# EAGLE design Graphic LCD Backpack (EAGLE 6.4)
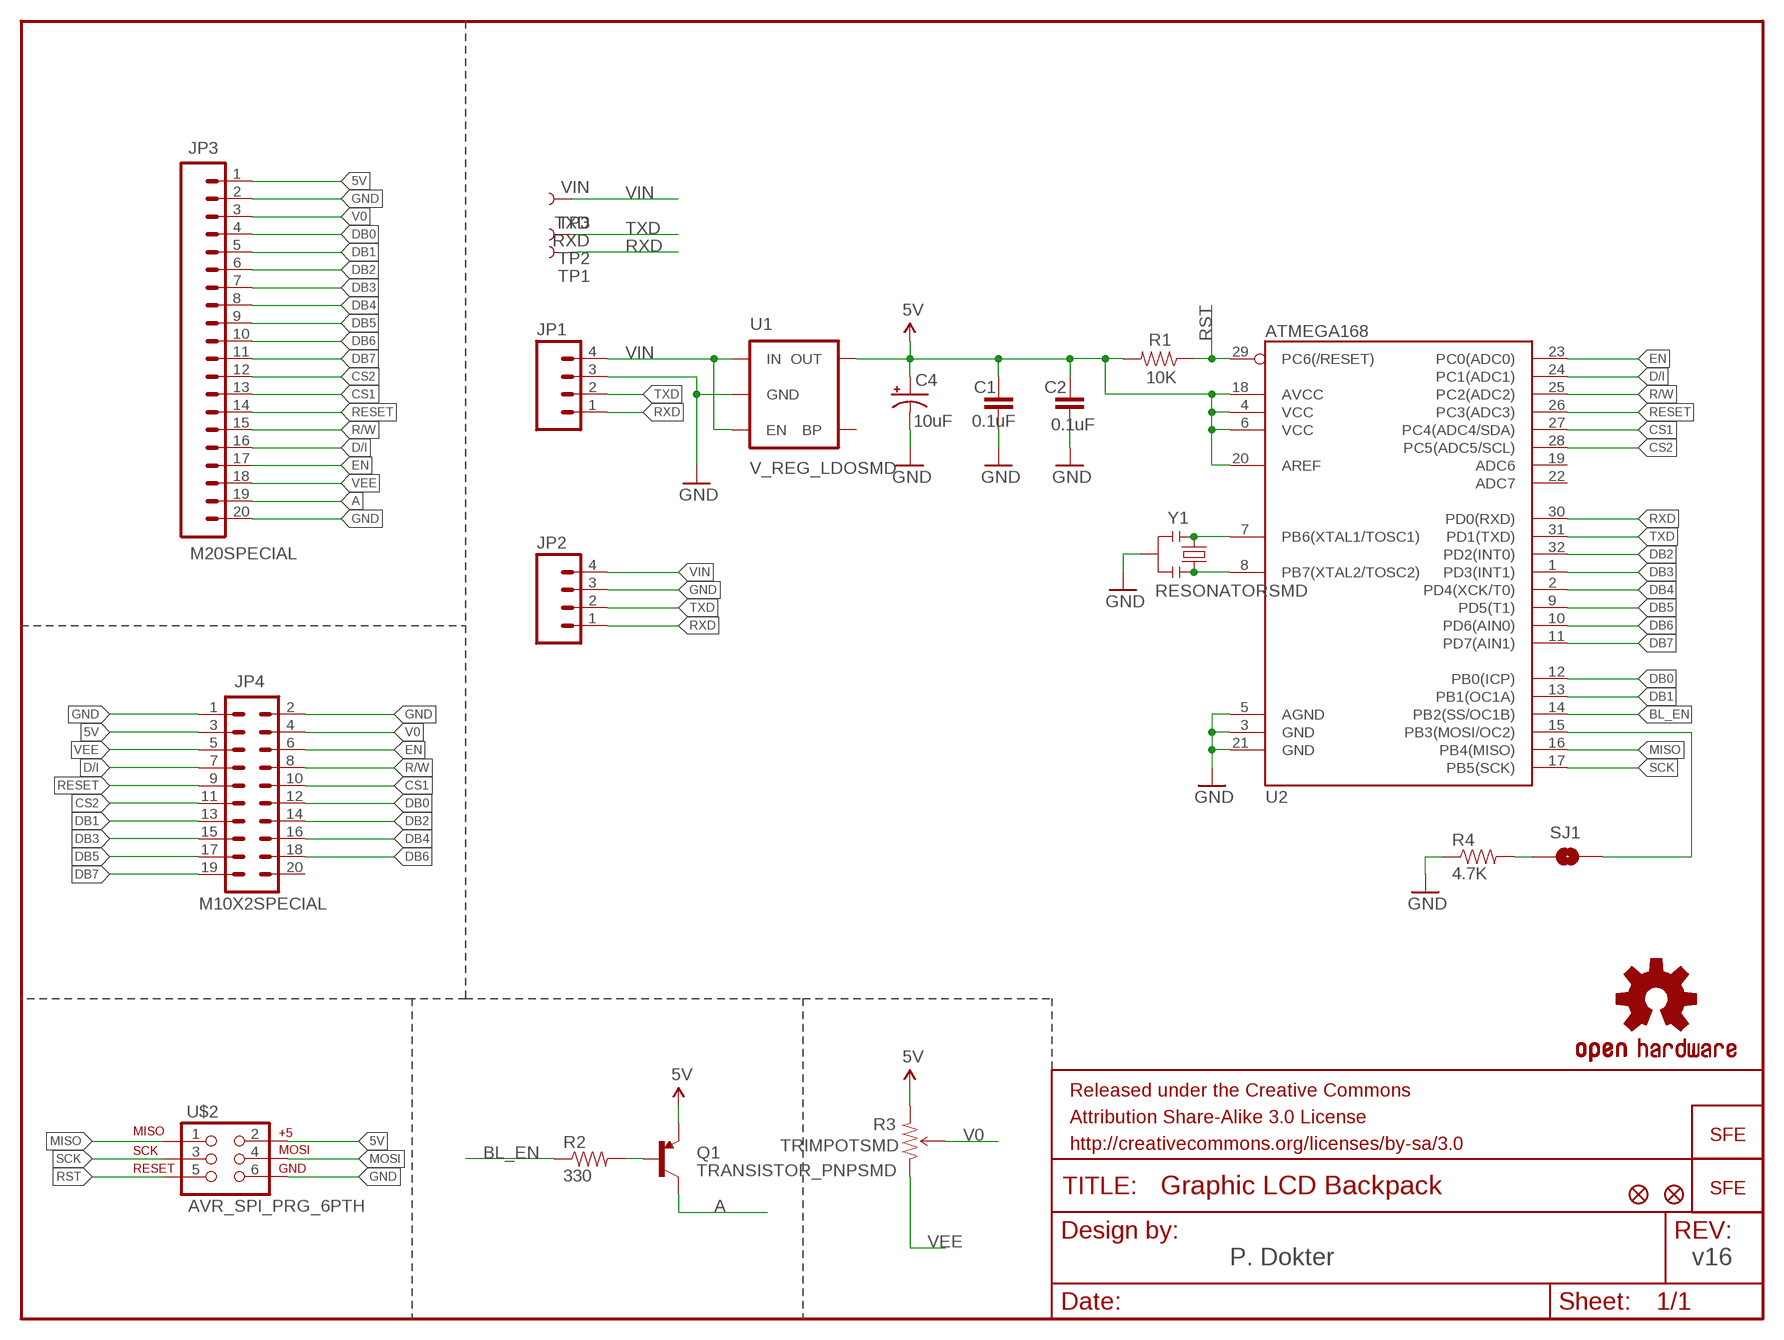
[diagram p0: schematic, sheet 1]

## Parts
C1  0.1uF  CAP0603-CAP  [0603-CAP]
C2  0.1uF  CAP0603-CAP  [0603-CAP]
C4  10uF  CAP_POL1206  [EIA3216]
FRAME1  FRAME-LETTER  [CREATIVE_COMMONS]
JP1  M04SMD  [1X04-SMD]
JP2  M04PTH  [1X04]
JP3  M20SPECIAL  [1X20_LOCK_SPECIAL]
JP4  M10X2SPECIAL  [2X10_LOCK_SPECIAL]
LOGO1  OSHW-LOGOL  [OSHW-LOGO-L]
LOGO2  LOGO-SFENEW  [SFE-NEW-WEBLOGO]
LOGO3  OSHW-LOGOS  [OSHW-LOGO-S]
Q1  TRANSISTOR_PNPSMD  [SOT23-3]
R1  10K  RESISTOR0603-RES  [0603-RES]
R2  330  RESISTOR0603-RES  [0603-RES]
R3  TRIMPOTSMD  [TRIMPOT-3MM]
R4  4.7K  RESISTOR0603-RES  [0603-RES]
SJ1  SOLDERJUMPERNC2  [SJ_2S-NOTRACE]
TP1  RXD  TEST-POINT3X5  [PAD.03X.05]
TP2  TXD  TEST-POINT3X5  [PAD.03X.05]
TP3  VIN  TEST-POINT3X5  [PAD.03X.05]
U1  V_REG_LDOSMD  [SOT23-5]
U2  ATMEGA168  [TQFP32-08]
U$2  AVR_SPI_PRG_6PTH  [2X3]
U$8  LOGO-SFENEW  [SFE-NEW-WEBLOGO]
U$9  FIDUCIAL1X2  [FIDUCIAL-1X2]
U$10  FIDUCIAL1X2  [FIDUCIAL-1X2]
Y1  RESONATORSMD  [RESONATOR-SMD]

## Nets
5V: C1.1 C2.2 C4.A(+) JP3.1 JP4.3 Q1.2(E) R1.2 R3.3(CW) U1.5(OUT) U2.4(VCC) U2.6(VCC) U2.18(AVCC) U2.20(AREF) U$2.2
A: JP3.19 Q1.3(C)
BL_EN: R2.1 U2.14(PB2(SS/OC1B))
CS1: JP3.13 JP4.10 U2.27(PC4(ADC4/SDA))
CS2: JP3.12 JP4.11 U2.28(PC5(ADC5/SCL))
D/I: JP3.16 JP4.7 U2.24(PC1(ADC1))
DB0: JP3.4 JP4.12 U2.12(PB0(ICP))
DB1: JP3.5 JP4.13 U2.13(PB1(OC1A))
DB2: JP3.6 JP4.14 U2.32(PD2(INT0))
DB3: JP3.7 JP4.15 U2.1(PD3(INT1))
DB4: JP3.8 JP4.16 U2.2(PD4(XCK/T0))
DB5: JP3.9 JP4.17 U2.9(PD5(T1))
DB6: JP3.10 JP4.18 U2.10(PD6(AIN0))
DB7: JP3.11 JP4.19 U2.11(PD7(AIN1))
EN: JP3.17 JP4.6 U2.23(PC0(ADC0))
GND: C1.2 C2.1 C4.C(-) JP1.3 JP2.3 JP3.2 JP3.20 JP4.1 JP4.2 R4.1 U1.2(GND) U2.3(GND) U2.5(AGND) U2.21(GND) U$2.6 Y1.2
MISO: U2.16(PB4(MISO)) U$2.1
MOSI: SJ1.2 U2.15(PB3(MOSI/OC2)) U$2.4
N$1: Q1.1(B) R2.2
N$2: U2.7(PB6(XTAL1/TOSC1)) Y1.1
N$3: U2.8(PB7(XTAL2/TOSC2)) Y1.3
N$4: R4.2 SJ1.1
R/W: JP3.15 JP4.8 U2.25(PC2(ADC2))
RESET: JP3.14 JP4.9 U2.26(PC3(ADC3))
RST: R1.1 U2.29(PC6(/RESET)) U$2.5
RXD: JP1.1 JP2.1 TP1.P$1 U2.30(PD0(RXD))
SCK: U2.17(PB5(SCK)) U$2.3
TXD: JP1.2 JP2.2 TP2.P$1 U2.31(PD1(TXD))
V0: JP3.3 JP4.4 R3.2(WIPER)
VEE: JP3.18 JP4.5 R3.1(CCW)
VIN: JP1.4 JP2.4 TP3.P$1 U1.1(IN) U1.3(EN)
Unconnected: JP4.20 U1.4(BP) U2.19(ADC6) U2.22(ADC7)

## Notes on the sheet
- P. Dokter | v16

## Library data of the parts
C1 C2 = SparkFun:CAP: Capacitor Standard 0603 ceramic capacitor, and 0.1" leaded capacitor.
C4 = SparkFun:CAP_POL: Capacitor Polarized These are standard SMD and PTH capacitors. Normally 10uF, 47uF, and 100uF in electrolytic and tantalum varieties. Always verify the external diameter of the through hole cap, it varies with capacity, voltage, and manufacturer. The EIA devices should be standard.
FRAME1 = SparkFun-Aesthetics:FRAME-LETTER: Schematic Frame Standard 8.5x11 US Letter frame
JP1 JP2 = SparkFun:M04: Header 4 Standard 4-pin 0.1" header. Use with straight break away headers (SKU : PRT-00116), right angle break away headers (PRT-00553), swiss pins (PRT-00743), machine pins (PRT-00117), and female headers (PRT-00115). Molex polarized connector foot print use with SKU : PRT-08231 with associated crimp pins and housings.
JP3 = SparkFun:M20: This is just like the LOCK variant in that the holes are staggared by 5 mil, but except for the last two holes. They are not altered from the "standard" footprint layout. This is used for a special purpose on the layout of our Graphic LCD Backpack. Make sure you want to use this device before selecting it for you project!
JP4 = SparkFun:M10X2: This was SPECIALLY designed to be used with our Graphic LCD Backpack. Be sure you want to use this! It is not only staggered on each line of header holes, but IT IS ALSO offset of the center point of the top and bottom lines by 5 mil. This causes the headers to lock into place on the "standard" footprint on the LCD screen. The extra squares on the tdocu layer are there simply to reference other pins (if you were to actually populate a longer header than ten long - this is what we do with the backpacks).
LOGO1 LOGO3 = SparkFun-Aesthetics:OSHW-LOGO: Open Source Hardware Logo This logo indicates the piece of hardware it is found on incorporates a OSHW license and/or adheres to the definition of open source hardware found here: http://freedomdefined.org/OSHW
LOGO2 = SparkFun-Aesthetics:LOGO-SFE: Spark Fun Electronics PCB Logo This is the standard Spark Fun Electronics PCB logo.
Q1 = SparkFun:TRANSISTOR_PNP
R1 R2 R4 = SparkFun:RESISTOR: Resistor Basic schematic elements and footprints for 0603, 1206, and PTH 1/10th watt (small) resistors.
R3 = SparkFun:TRIMPOT
SJ1 = SparkFun:SOLDERJUMPER: Solder Jumper Standard SMD solder jumper. Used to automate production. Two varients : Normally Open and Normally Closed are the same, but have different paste layers. NC will have a large amount of paste and should jumper during reflow.
TP1-TP3 = SparkFun:TEST-POINT
U1 = SparkFun:V_REG_LDO: Voltage Regulator LDO Standard 150mA LDO voltage regulator in SOT-23 layout. Micrel part MIC5205. BP (by-pass) pin is used to lower output noise with 470pF cap.
U2 = SparkFun:ATMEGA168
U$2 = SparkFun:AVR_SPI_PRG_6: AVR ISP 6 Pin This is the reduced ISP connector for AVR programming. Common on Arduino. This footprint will take up less PCB space and can be used with a 10-pin to 6-pin adapter such as SKU: BOB-08508
U$8 = SparkFun:LOGO-SFE: Spark Fun Electronics PCB Logo This is the standard Spark Fun Electronics PCB logo.
U$9 U$10 = SparkFun:FIDUCIAL: Fiducial Alignment Points Various fiducial points for machine vision alignment.
Y1 = SparkFun:RESONATOR: Resonator Small SMD resonator. This is the itty bitty 10/20MHz resonators with built in caps. CSTCE10M0G55 and CSTCE20M0V53. Footprint has been reviewed closely but hasn't been tested yet.

## Board
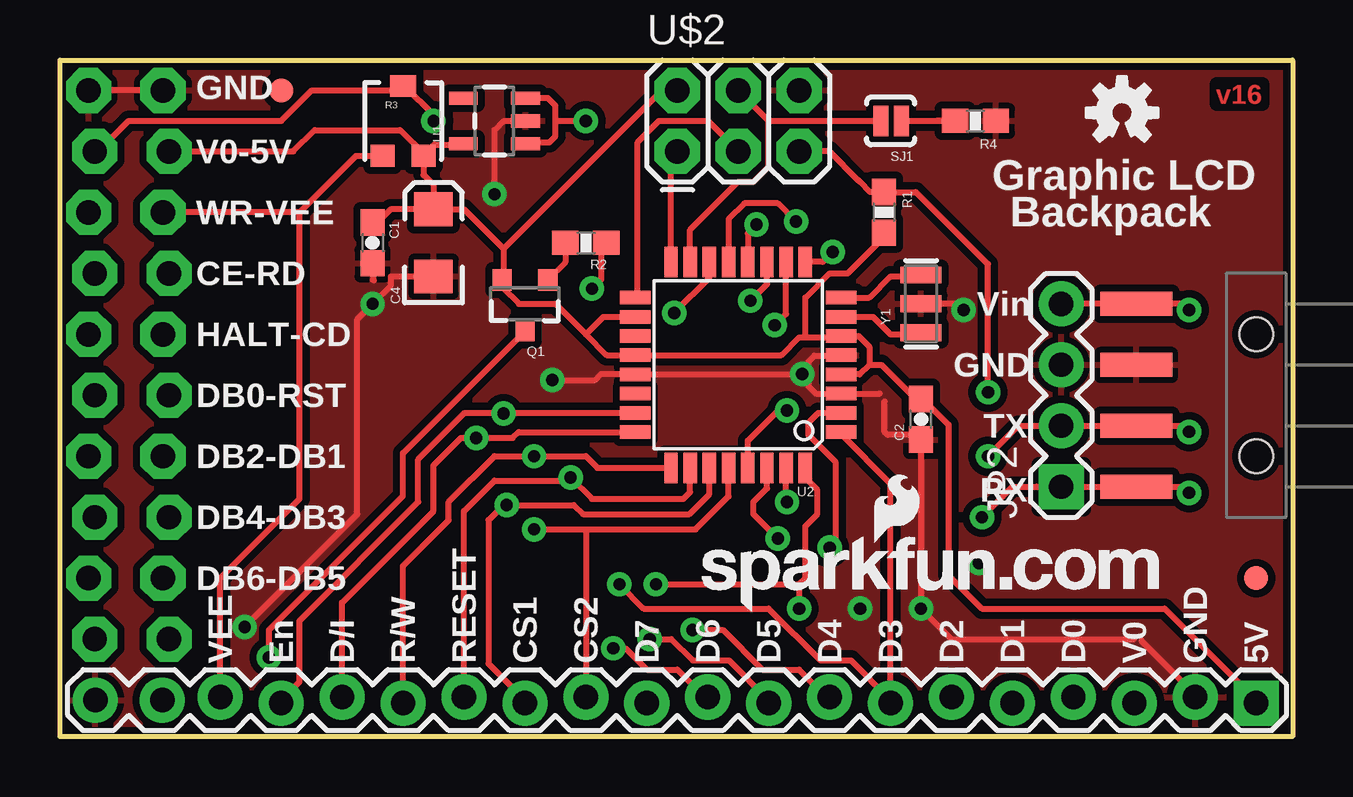
[diagram p1: board, top side]
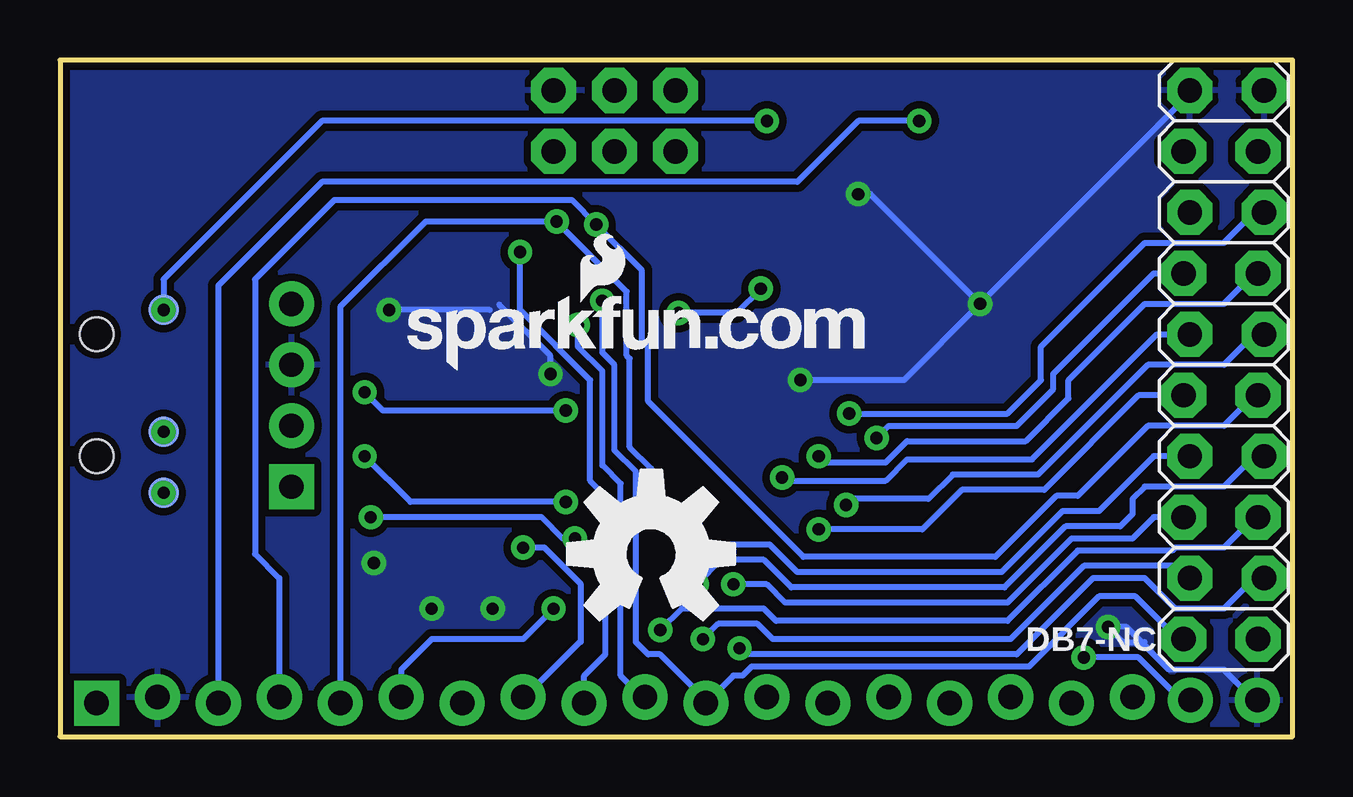
[diagram p2: board, bottom side, seen from below]

Size 51.38 x 28.19 mm. Coordinates in mm from the lower left corner, seen from the top.
Outline: 0,0 0,28.19 51.38,28.19 51.38,0 0,0
Copper layers (1*16): Top 0.035mm / dielectric 1.5mm / Bottom 0.035mm
Design rules "SparkFun *": minimum track width 8mil, minimum drill 20mil, track to track 8mil, track to pad 8mil, pad to pad 8mil, via to via 8mil, smd to smd 6mil, copper to edge 8mil, drill to drill 8mil, minimum pad ring 12mil, minimum via ring 10mil, stop-mask expansion 4mil, vias tented up to drill 25mil, thermal gap 10mil

### Footprints (pad centres in the part's own frame; a part is rotated, then mirrored left to right if it is on the bottom)
0603-CAP = smd 1.1 x 1: 1 -0.85,0; 2 0.85,0
EIA3216 = smd 1.4 x 1.6: A 1.4,0; C -1.4,0
1X04-SMD = smd 1 x 3: 1 -3.81,5; 2 -1.27,5; 3 1.27,5; 4 3.81,5 | hole 1.4: -2.54,0; 2.54,0
1X04 = drill 1.016 pad 1.88 square: 1 0,0 | drill 1.016 pad 1.88: 2 2.54,0; 3 5.08,0; 4 7.62,0
1X20_LOCK_SPECIAL = drill 1.016 pad 1.88 square: 1 0,0.127 | drill 1.016 pad 1.88: 2 2.54,-0.127; 3 5.08,0.127; 4 7.62,-0.127; 5 10.16,0.127; 6 12.7,-0.127; 7 15.24,0.127; 8 17.78,-0.127; 9 20.32,0.127; 10 22.86,-0.127; 11 25.4,0.127; 12 27.94,-0.127; 13 30.48,0.127; 14 33.02,-0.127; 15 35.56,0.127; 16 38.1,-0.127; 17 40.64,0.127; 18 43.18,-0.127; 19 45.593,0; 20 48.387,0
2X10_LOCK_SPECIAL = drill 1.016 pad 1.88 octagon: 1 -11.43,-1.422; 2 -11.43,1.676; 3 -8.89,-1.676; 4 -8.89,1.422; 5 -6.35,-1.422; 6 -6.35,1.676; 7 -3.81,-1.676; 8 -3.81,1.422; 9 -1.27,-1.422; 10 -1.27,1.676; 11 1.27,-1.676; 12 1.27,1.422; 13 3.81,-1.422; 14 3.81,1.676; 15 6.35,-1.676; 16 6.35,1.422; 17 8.89,-1.422; 18 8.89,1.676; 19 11.43,-1.676; 20 11.43,1.422
SOT23-3 = smd 0.8 x 0.9: 1 -0.95,-1; 2 0.95,-1; 3 0,1.1
0603-RES = smd 1.1 x 1: 1 -0.85,0; 2 0.85,0
TRIMPOT-3MM = smd 1 x 0.9: 1 -0.85,-1.45; 3 0.85,-1.45 | smd 1.1 x 0.9: 2 0,1.45
SJ_2S-NOTRACE = smd 0.635 x 1.27: 1 -0.45,0; 2 0.4,0
PAD.03X.05 = smd 1.27 x 1.27: P$1 0,0
SOT23-5 = smd 0.55 x 1.2: 1 -0.95,-1.3; 2 0,-1.3; 3 0.95,-1.3; 4 0.95,1.3; 5 -0.95,1.3
TQFP32-08 = smd 1.27 x 0.559: 1 -4.293,2.8; 2 -4.293,2; 3 -4.293,1.2; 4 -4.293,0.4; 5 -4.293,-0.4; 6 -4.293,-1.2; 7 -4.293,-2; 8 -4.293,-2.8; 17 4.293,-2.8; 18 4.293,-2; 19 4.293,-1.2; 20 4.293,-0.4; 21 4.293,0.4; 22 4.293,1.2; 23 4.293,2; 24 4.293,2.8 | smd 0.559 x 1.27: 9 -2.8,-4.293; 10 -2,-4.293; 11 -1.2,-4.293; 12 -0.4,-4.293; 13 0.4,-4.293; 14 1.2,-4.293; 15 2,-4.293; 16 2.8,-4.293; 25 2.8,4.293; 26 2,4.293; 27 1.2,4.293; 28 0.4,4.293; 29 -0.4,4.293; 30 -1.2,4.293; 31 -2,4.293; 32 -2.8,4.293
2X3 = drill 1.016 pad 1.88 octagon: 1 0,0; 2 0,2.54; 3 2.54,0; 4 2.54,2.54; 5 5.08,0; 6 5.08,2.54
FIDUCIAL-1X2 = smd 1 x 1: 1 0,0
RESONATOR-SMD = smd 0.7 x 1.7: 1 -1.2,0; 2 0,0; 3 1.2,0

### Placement (x,y rotation side)
C1  13.03,20.57 270 top
C2  35.89,13.22 90 top
C4  15.57,20.57 90 top
FRAME1  -0.28,-6.35 0 top  (outside the outline)
JP1  49.86,14.22 90 top
JP2  41.73,10.41 90 top
JP3  49.86,1.52 180 top
JP4  2.87,15.49 270 bottom
LOGO1  26.75,7.62 0 bottom
LOGO2  36.91,15.24 0 bottom
LOGO3  44.27,26 0 top
Q1  19.38,18.03 180 top
R1  34.35,21.84 270 top
R2  21.92,20.57 180 top
R3  14.3,25.65 0 top
R4  38.16,25.65 180 top
SJ1  34.62,25.65 180 top
TP1  47.07,10.16 0 bottom
TP2  47.07,12.7 0 bottom
TP3  47.07,17.78 0 bottom
U1  18.11,25.65 90 top
U2  28.27,15.49 180 top
U$2  25.73,24.38 0 top
U$8  26.75,5.21 0 top
U$9  9.22,26.92 0 top
U$10  49.86,6.6 0 top
Y1  35.89,18.03 90 top

### Tracks (layer width: path | path; a pad name or v marks a point on that pad's centre or on a via)
5V
  Top 0.254: 16.81,24.67 U1.5 | 21.92,16.76 20.65,18.03 19.13,18.03 18.43,18.73 Q1.2 18.48,19.03 18.49,19.05 18.49,20.32 | 16.81,24.67 17.12,24.67 | 33.73,15.49 33.73,16.26 33.29,16.69 U2.6 32.56,16.66 32.59,16.64 31.06,16.64 | 33.73,15.49 34.24,15.49 35.66,14.07 C2.2 36,14.07 36.08,14 36.08,13.96 37.03,13 37.03,6.73 38.43,5.33 46.05,5.33 49.86,1.52 JP3.1 | U2.18 22.65,17.49 21.92,16.76 | 21.92,16.76 22.79,15.89 U2.20 30.07,15.89 30.81,16.64 31.06,16.64 | U$2.2 25.1,26.92 18.49,20.32 | 31.06,16.64 31.06,18.29 32.08,19.3 32.84,19.3 34.35,20.81 R1.2 | U2.4 33.33,15.09 33.73,15.49 | 16.81,24.67 15.6,24.67 15.19,24.26 | JP4.3 9.73,24.38 10.62,25.27 14.17,25.27 15.19,24.26 | 15.19,24.26 15.15,24.22 R3.3 15.15,23.41 15.57,22.99 C4.A | C4.A 13.78,21.97 13.23,21.42 C1.1 | C4.A 16.84,21.97 18.49,20.32
A  (via drill 0.51)
  Top 0.254: Q1.3 19.38,16.89 14.3,11.81 14.3,10.03 8.71,4.45 v8.71,3.3
  Bottom 0.254: v8.71,3.3 6.43,3.3 4.65,1.52 JP3.19
BL_EN  (via drill 0.51)
  Top 0.254: R2.1 22.56,20.57 22.56,19.05 v22.17,18.67 | U2.14 27.07,19.12 v25.6,17.65
  Bottom 0.254: v25.6,17.65 23.19,17.65 v22.17,18.67
CS1  (via drill 0.51)
  Top 0.254: U2.27 27.07,10.1 26.24,9.27 21.79,9.27 21.41,9.65 v18.62,9.65 18.49,9.65 17.86,9.02 17.86,3.05 19.38,1.52 JP3.13
  Bottom 0.254: v18.62,9.65 18.36,9.91 15.19,9.91 14.17,10.92 10.62,10.92 6.05,15.49 2.87,15.49 1.6,16.76 JP4.10
CS2  (via drill 0.51)
  Top 0.254: v19.76,8.64 21.92,8.64 | 21.92,8.64 26.49,8.64 27.87,10.01 U2.28 | 21.92,8.64 JP3.12
  Bottom 0.254: JP4.11 6.43,14.22 10.36,10.29 13.79,10.29 15.44,8.64 v19.76,8.64
D/I  (via drill 0.51)
  Top 0.254: JP3.16 11.76,5.59 15.57,9.4 15.57,11.3 16.71,12.45 v17.35,12.45 18.87,12.45 19.13,12.7 19.13,12.69 U2.24
  Bottom 0.254: JP4.7 5.79,19.3 9.98,15.11 9.98,14.48 11.51,12.95 16.84,12.95 v17.35,12.45
DB0  (via drill 0.51)
  Top 0.254: U2.12 28.67,20.97 v29.03,21.34
  Bottom 0.254: JP3.4 42.24,6.6 43.26,7.62 43.26,19.05 39.95,22.35 30.05,22.35 v29.03,21.34 27.13,19.43 27.13,16.51 26.87,16.26 26.87,13.97 20.4,7.49 12.4,7.49 9.86,10.03 8.97,10.03 6.05,12.95 2.87,12.95 1.6,14.22 JP4.12
DB1  (via drill 0.51)
  Top 0.254: U2.13 27.87,21.57 28.52,22.23 29.92,22.23 v30.68,21.46
  Bottom 0.254: JP3.5 39.7,17.91 36.14,21.46 v30.68,21.46 27.76,18.54 27.76,15.88 27.64,15.75 27.64,12.06 26.75,11.18 26.75,9.91 24.84,8 21.79,8 20.65,6.86 12.14,6.86 9.6,9.4 8.08,9.4 5.79,11.68 JP4.13
DB2  (via drill 0.51)
  Top 0.254: 30.81,6.35 v30.81,5.33 | v24.84,6.35 30.81,6.35 | U2.32 31.07,10.79 31.57,10.29 31.57,9.27 31.06,8.76 31.06,6.6 30.81,6.35
  Bottom 0.254: JP3.6 37.16,2.79 35.89,4.06 32.08,4.06 v30.81,5.33 | v24.84,6.35 23.83,7.37 22.05,7.37 20.9,6.22 12.01,6.22 9.47,8.76 7.19,8.76 6.68,9.27 6.68,9.91 6.17,10.41 2.87,10.41 1.6,11.68 JP4.14
DB3  (via drill 0.51)
  Top 0.254: v23.32,6.35 24.33,5.33 29.54,5.33 31.7,3.17 32.97,3.17 34.62,1.52 JP3.7 34.62,10.54 32.56,12.6 U2.1
  Bottom 0.254: v23.32,6.35 21.92,6.35 21.16,5.59 11.89,5.59 9.22,8.26 6.68,8.26 5.79,9.14 JP4.15
DB4  (via drill 0.51)
  Top 0.254: v32.08,7.87 32.33,8.13 32.33,11.43 31.19,12.57 31.19,13.08 31.6,13.49 U2.2 | v26.37,4.45 27.64,4.45 29.29,2.79 30.81,2.79 31.95,1.65 JP3.8
  Bottom 0.254: v32.08,7.87 31.19,7.87 29.67,6.35 29.67,4 | 29.67,3.94 29.67,4 | v26.37,4.45 25.48,5.33 22.05,5.33 21.54,4.83 11.89,4.83 8.97,7.75 5.03,7.75 4.9,7.87 2.87,7.87 1.6,9.14 JP4.16 | JP3.8 32.02,1.65 29.67,4
DB5  (via drill 0.51)
  Top 0.254: U2.9 31.8,19.79 v32.21,20.19 | v24.59,4.06 25.48,4.06 26.37,3.17 27.89,3.17 29.54,1.52 JP3.9
  Bottom 0.254: v24.59,4.06 23.95,4.7 22.3,4.7 21.67,4.06 11.76,4.06 8.71,7.11 4.65,7.11 4.65,6.96 JP4.17 | JP3.9 29.54,2.54 28.65,3.43 28.65,10.03 29.29,10.67 29.29,14.86 32.21,17.78 v32.21,20.19
DB6  (via drill 0.51)
  Top 0.254: v23.06,3.68 23.57,3.68 24.46,2.79 25.73,2.79 26.87,1.65 JP3.10 | U2.10 30.27,17.62 v29.79,17.14
  Bottom 0.254: v23.06,3.68 22.81,3.43 11.51,3.43 8.33,6.6 6.17,6.6 4.9,5.33 2.87,5.33 1.6,6.6 JP4.18 | v29.79,17.14 29.79,16.26 28.78,15.24 28.78,11.3 28.02,10.54 28.02,2.54 27.13,1.65 JP3.10
DB7  (via drill 0.51)
  Top 0.254: U2.11 29.47,18.85 v28.78,18.16
  Bottom 0.254: JP4.19 4.78,4.06 6.55,5.84 8.08,5.84 11,2.92 22.56,2.92 22.94,2.54 23.32,2.54 JP3.11 24.46,1.52 26.37,3.43 26.87,3.43 27.38,3.94 27.38,11.05 28.27,11.94 28.27,15.49 28.78,16 v28.78,18.16
EN  (via drill 0.51)
  Top 0.254: U2.23 18.52,13.49 v18.49,13.46 18.36,13.46 18.36,13.49 16.87,13.49 14.94,11.56 14.94,9.78 9.98,4.83 9.98,2.29 9.22,1.52 JP3.17
  Bottom 0.254: v18.49,13.46 11.89,13.46 10.49,14.86 10.49,16.26 6.17,20.57 2.87,20.57 1.6,21.84 JP4.6
GND  (via drill 0.51)
  Top 0.254: 44.78,4.06 37.16,4.06 v35.89,5.33 C2.1 35.89,12.57 34.49,12.57 34.37,12.7 34.37,13.97 | v7.7,4.57 12.4,9.27 12.4,17.4 v13.03,18.03 13.79,18.8 13.79,19.18 C4.C | JP4.1 JP4.2 | 34.17,14.29 U2.3 31.5,14.29 31.19,14.61 31.19,15.11 | v20.52,14.86 22.3,14.86 22.56,15.11 23.95,15.11 U2.21 30.68,15.09 | 31.19,15.11 31.19,15.62 31.45,15.88 32.59,15.88 U2.5 | 30.68,15.09 31.17,15.09 31.19,15.11 | Y1.2 37.41,18.03 v37.67,17.78 | 30.68,15.09 30.68,15.11 v30.94,15.11 | U1.2 18.49,25.65 18.11,25.27 v18.11,22.61 | JP1.3 45.54,15.49 | JP3.2 47.32,1.76 45.08,4 | 13.05,19.97 13.08,20 13.08,19 13.05,19.03 13.05,19.97
  Bottom 0.254: 1.73,1.52 JP3.20 1.6,1.52 2.87,2.79 5.16,2.79 6.93,4.57 v7.7,4.57 7.06,3.94 6.17,3.94 | 33.48,17.78 v37.67,17.78 | v20.52,14.86 16.21,14.86 v13.03,18.03 17.6,22.61 v18.11,22.61 | JP4.1 4.29,26.78 13.08,18 | v30.94,15.11 30.94,15.86 33.08,18
  other vias: 33.35,5.33 38.3,7.24
  pour Bottom (isolate 0.305): 0,0 51.38,0 51.38,28.19 0.08,28.19
  pour Top (isolate 0.305): 0,0 51.38,0 51.38,28.19 0,28.19
MISO
  Top 0.254: U2.16 25.47,24.12 U$2.1
MOSI
  Top 0.254: U2.15 26.27,21.11 28.27,23.11 28.91,23.11 29.54,23.75 29.54,25.65 | 29.54,25.65 U$2.4 | 29.54,25.65 SJ1.2
N$1
  Top 0.254: 20.27,19.05 20.29,19.03 Q1.1 21.07,19.77 R2.2
N$2
  Top 0.254: U2.7 33.89,17.49 34.62,16.76 35.89,16.76 Y1.1
N$3
  Top 0.254: U2.8 33.74,18.29 34.62,19.18 36.02,19.18 35.96,19.23 Y1.3
N$4
  Top 0.254: 36.53,25.65 R4.2 SJ1.1
R/W  (via drill 0.51)
  Top 0.254: JP3.15 14.3,7.11 16.21,9.02 16.21,9.78 18.11,11.68 v19.76,11.68 21.92,11.68 22.4,11.2 U2.25
  Bottom 0.254: v19.76,11.68 19.51,11.43 16.97,11.43 16.08,12.32 11.13,12.32 9.35,14.1 9.35,14.86 6.17,18.03 2.87,18.03 1.6,19.3 JP4.8
RESET  (via drill 0.51)
  Top 0.254: JP3.14 16.84,9.4 18.11,10.67 21.16,10.67 v21.29,10.79 22.17,9.91 25.98,9.91 26.27,10.19 U2.26
  Bottom 0.254: JP4.9 5.66,16.76 10.87,11.56 16.08,11.56 16.97,10.67 21.16,10.67 v21.29,10.79
RST  (via drill 0.51)
  Top 0.254: U$2.5 32.08,24.38 33.27,23.19 33.35,23.11 33.77,22.69 R1.1 35.68,22.69 38.68,19.68 v38.68,14.35 | U2.29 28.67,12.34 29.92,13.59 v30.3,13.59
  Bottom 0.254: v30.3,13.59 37.92,13.59 v38.68,14.35
RXD  (via drill 0.51)
  Top 0.254: v38.43,9.14 39.7,10.41 40.72,10.41 JP2.1 JP1.1 46.81,10.41 TP1.P$1 | U2.30 29.47,10.34 28.91,9.78 28.91,9.27 v29.92,8.26
  Bottom 0.254: v38.43,9.14 31.32,9.14 30.43,8.26 v29.92,8.26
  other vias: 47.07,10.16
SCK
  Top 0.254: U$2.3 27,25.65 24.97,25.65 24.08,24.77 24.08,18.41 23.96,18.29 | 23.96,18.29 23.95,18.29 | U2.17 23.96,18.29
TXD  (via drill 0.51)
  Top 0.254: JP2.2 JP1.2 | U2.31 30.27,9.81 v30.3,9.78 | JP1.2 46.81,12.95 TP2.P$1 | JP2.2 JP1.2 | JP2.2 39.95,12.95 v38.68,11.68
  Bottom 0.254: v30.3,9.78 36.78,9.78 v38.68,11.68
  other vias: 47.07,12.7
V0  (via drill 0.51)
  Top 0.254: v15.57,25.65 15.57,25.91 14.37,27.1 R3.2 14.3,27.18 14.05,26.92 10.49,26.92 9.22,25.65 2.87,25.65 1.6,24.38 JP4.4
  Bottom 0.254: v15.57,25.65 18.11,25.65 20.65,23.11 40.46,23.11 44.78,18.8 JP3.3
VEE
  Top 0.254: JP3.18 6.68,6.6 9.98,9.91 9.98,21.84 | 9.98,21.84 JP4.5 | R3.1 12.34,24.2 9.98,21.84
VIN  (via drill 0.51)
  Top 0.254: 19.38,26.67 19.41,26.64 U1.3 20.34,26.6 20.65,26.29 20.65,25.65 | 20.65,25.65 20.65,25.02 20.4,24.77 19.51,24.77 19.45,24.7 U1.1 | 20.65,25.65 v21.92,25.65 | TP3.P$1 46.81,18.03 JP1.4 JP2.4
  Bottom 0.254: v21.92,25.65 40.46,25.65 47.07,19.05 TP3.P$1
  other vias: 47.07,17.78

### Text on the board
Top: v16
tPlace: GND | V0-5V | Graphic LCD | WR-VEE | Backpack | CE-RD | Vin | HALT-CD | GND | DB0-RST | TX | DB2-DB1 | RX | DB4-DB3 | DB6-DB5 | VEE | En | D/I | R/W | RESET | CS1 | CS2 | D7 | D6 | D5 | D4 | D3 | D2 | D1 | D0 | V0 | GND | 5V
bPlace: DB7-NC